# EAGLE board Filter Board (EAGLE 9.5.1)
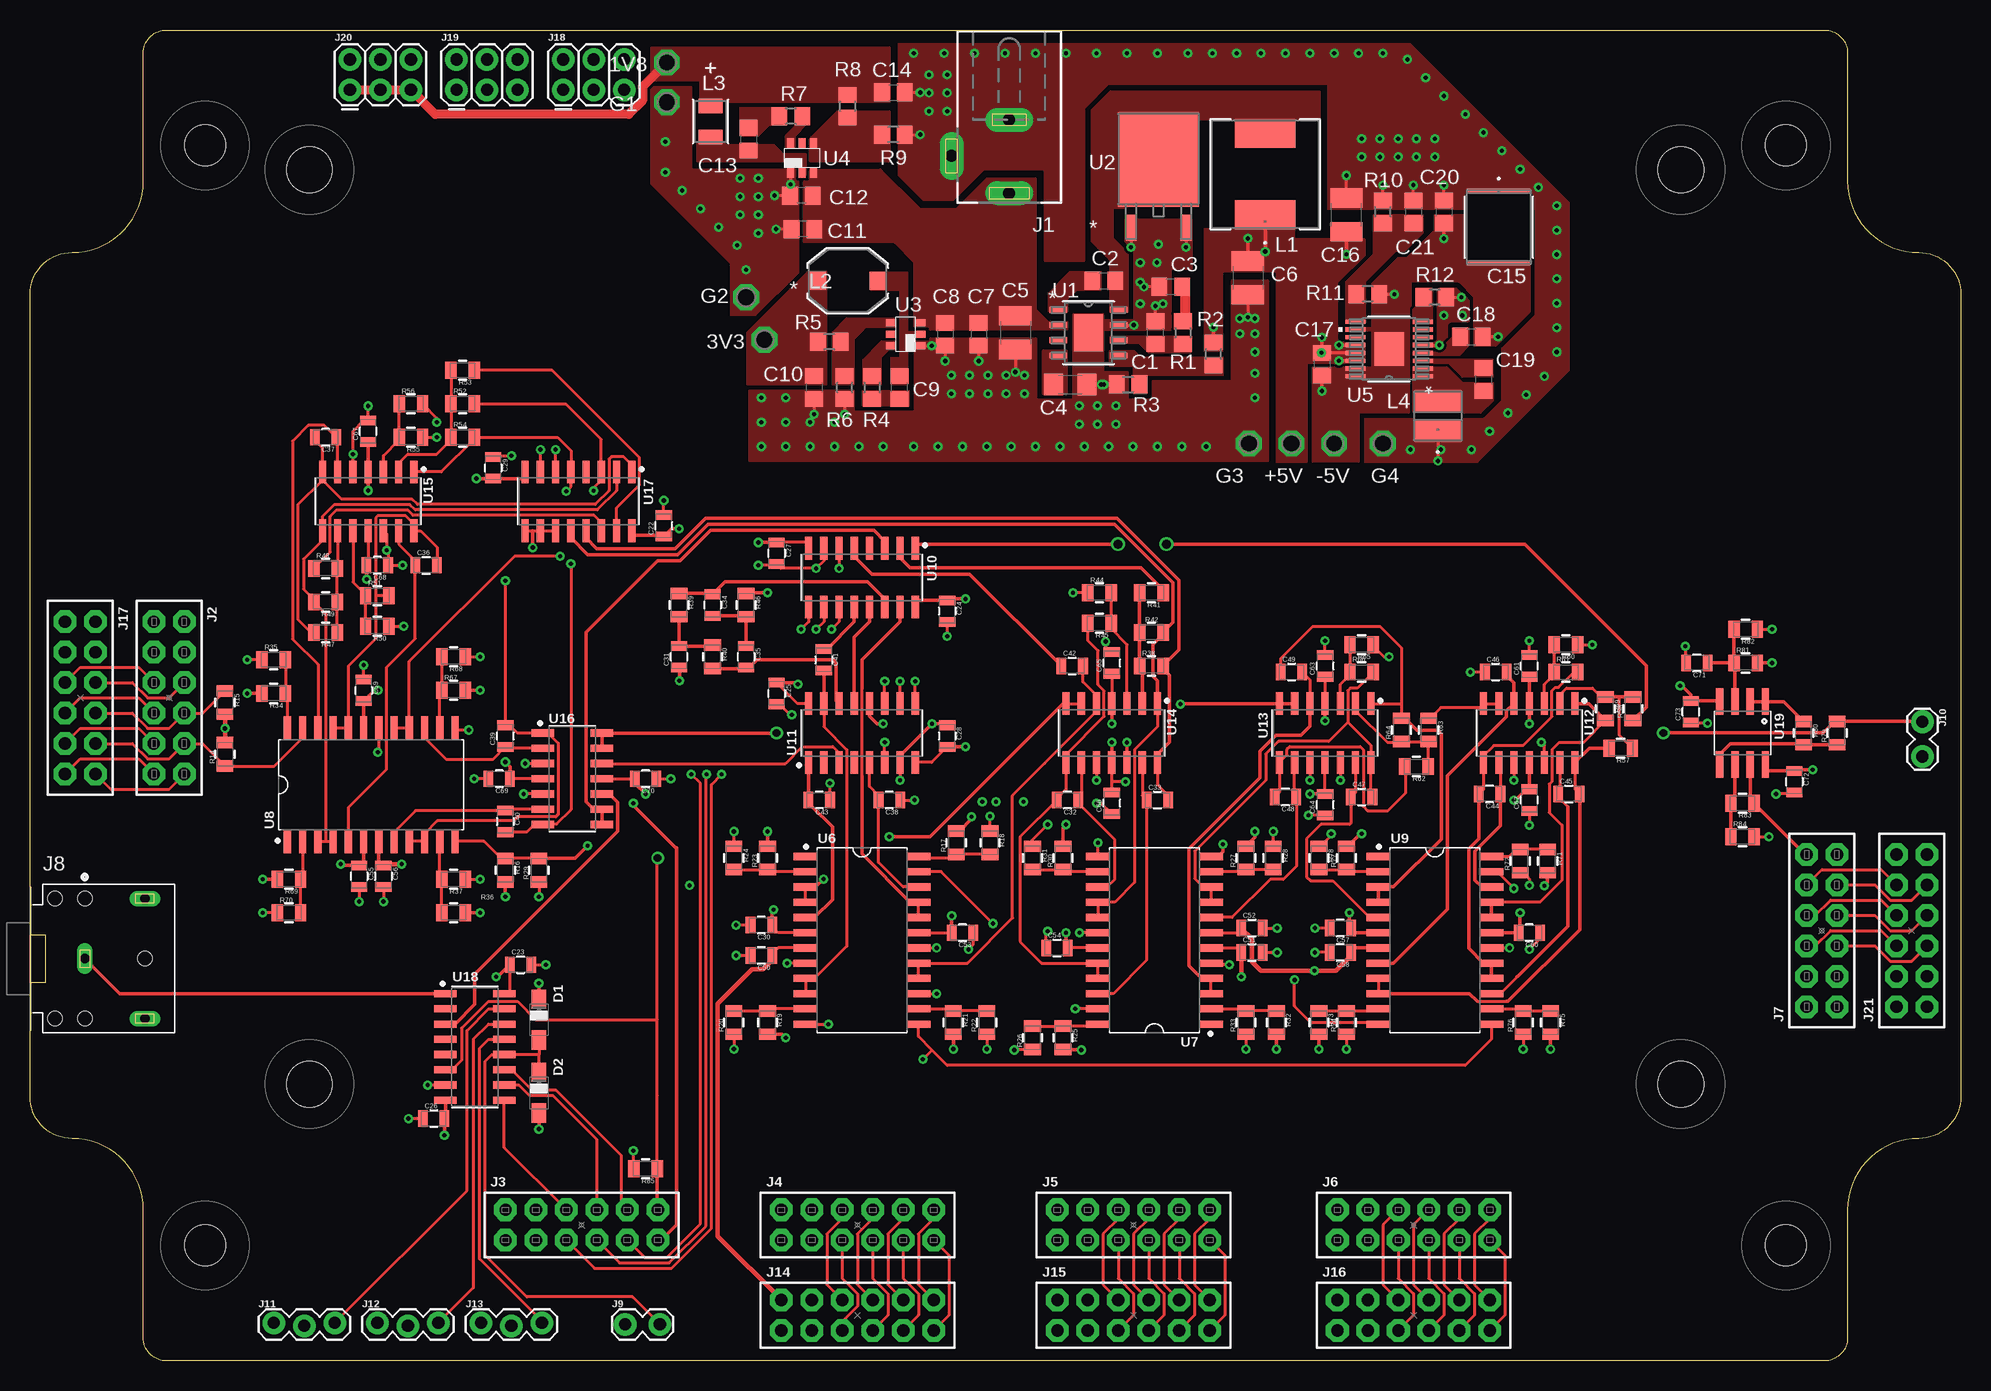
[diagram p5: board, top side]
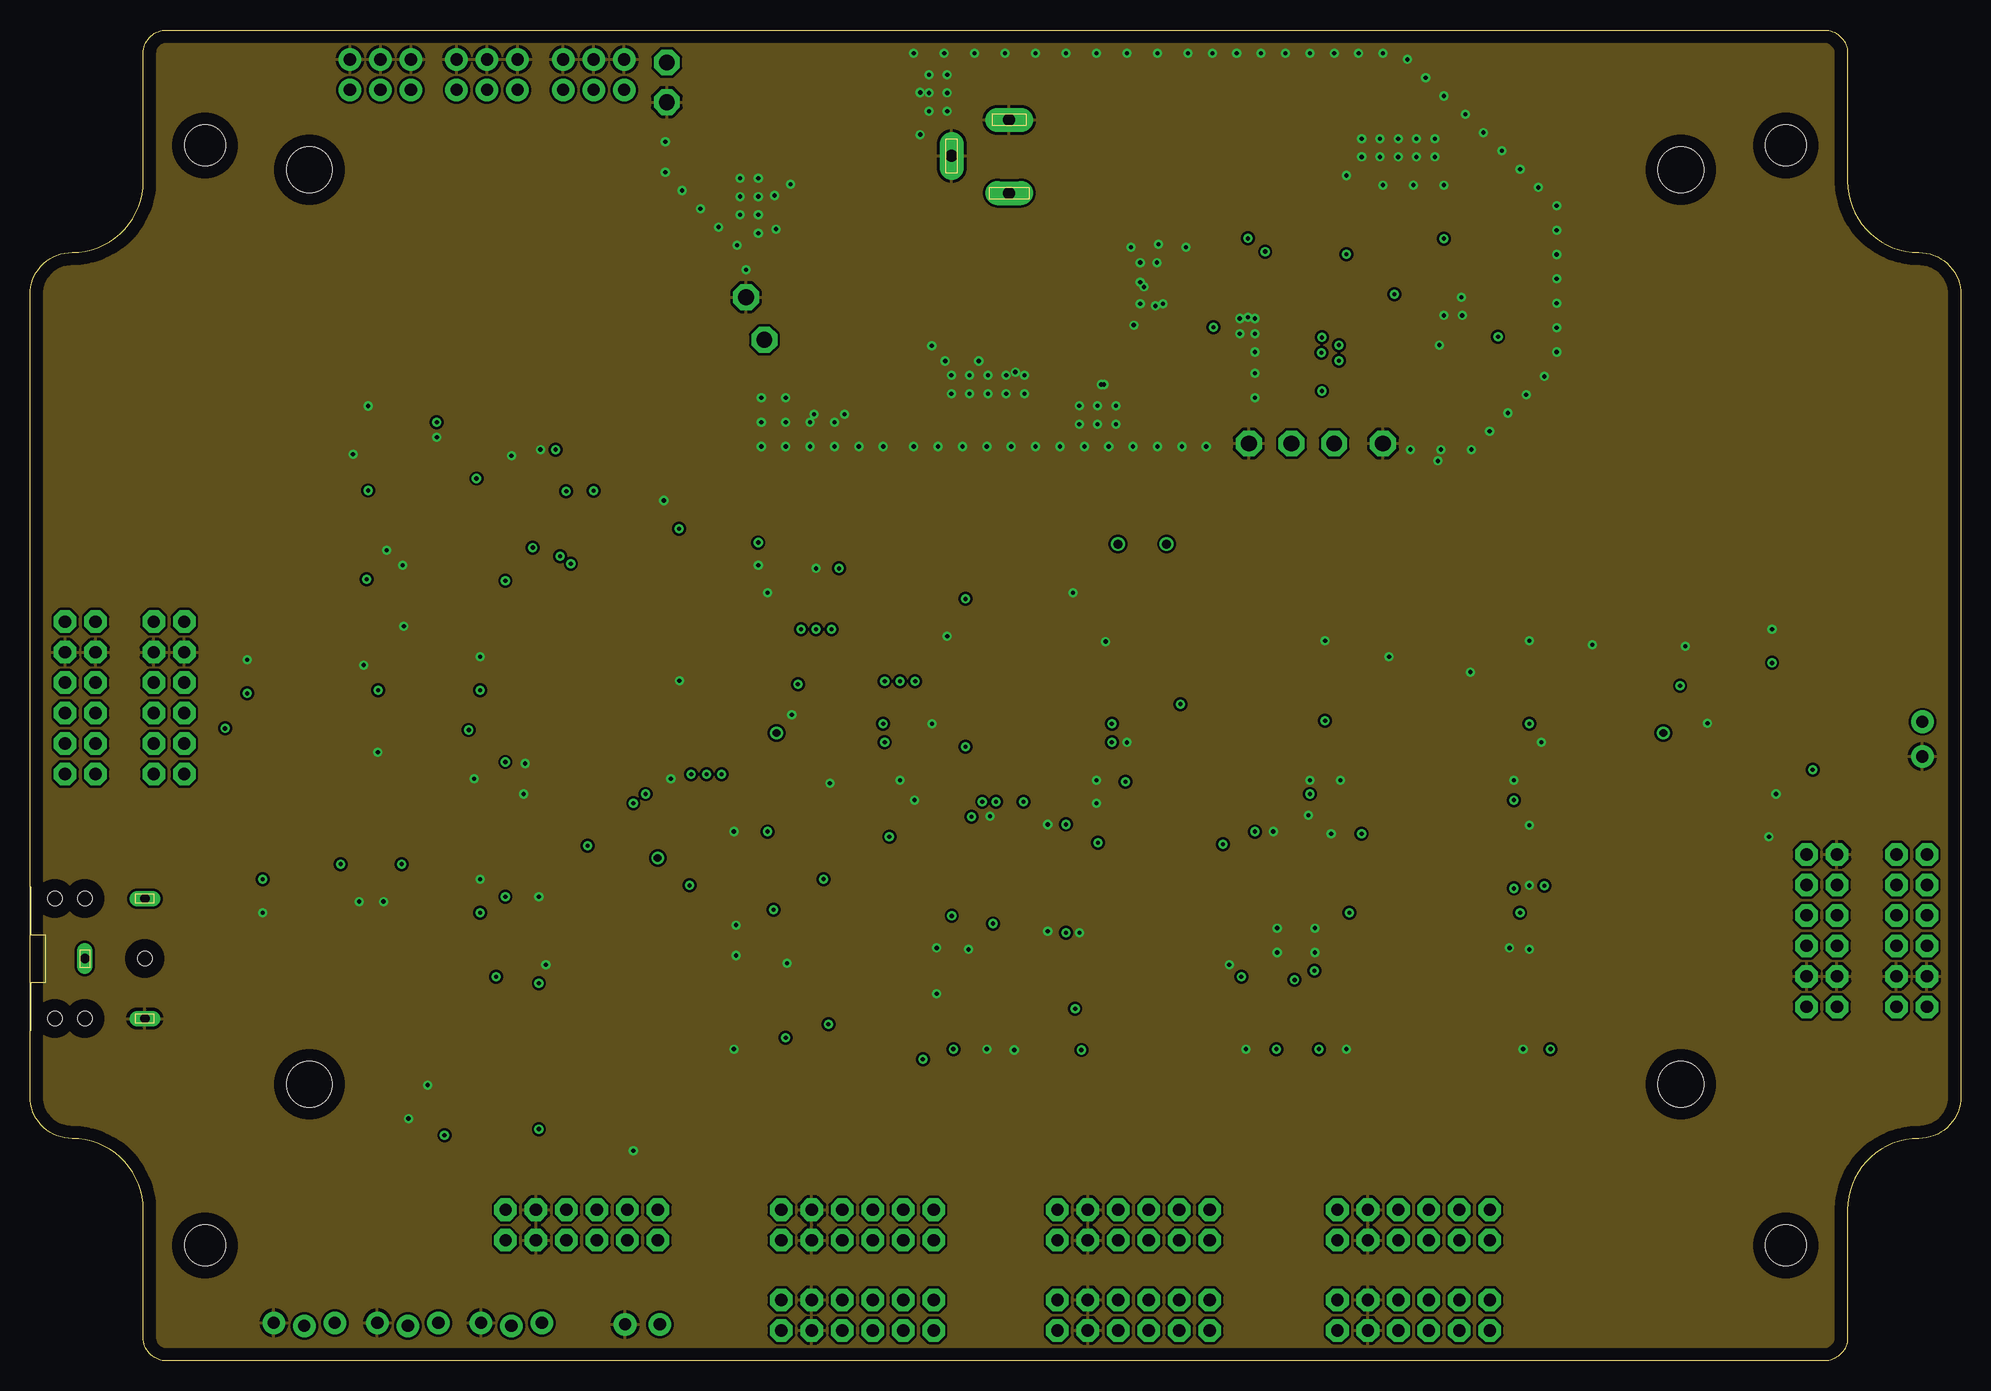
[diagram p6: board, inner layer Route2]
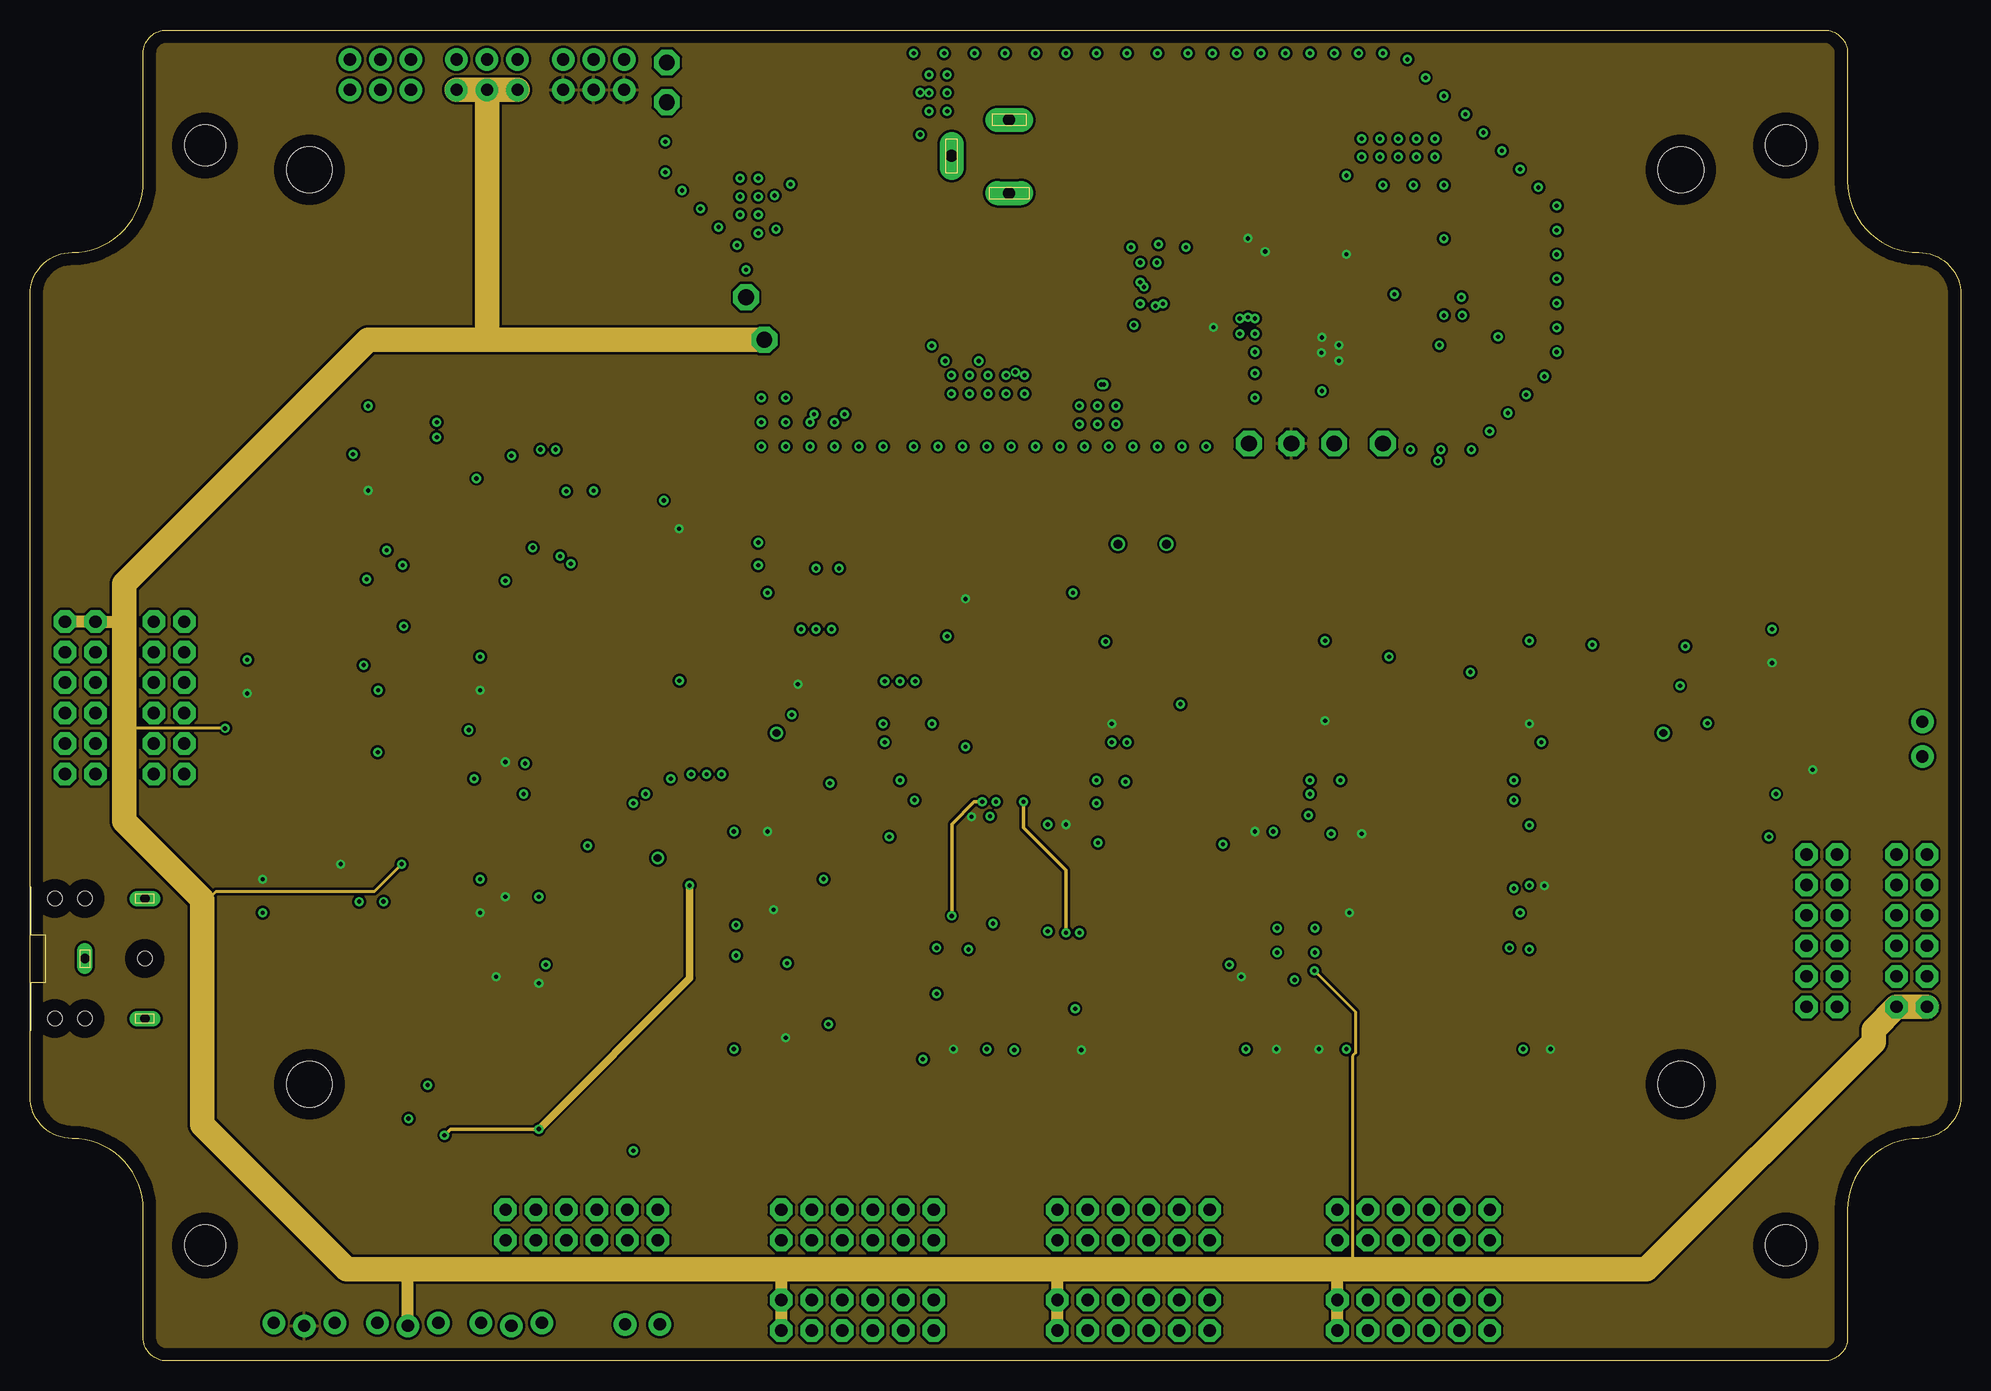
[diagram p7: board, inner layer Route15]
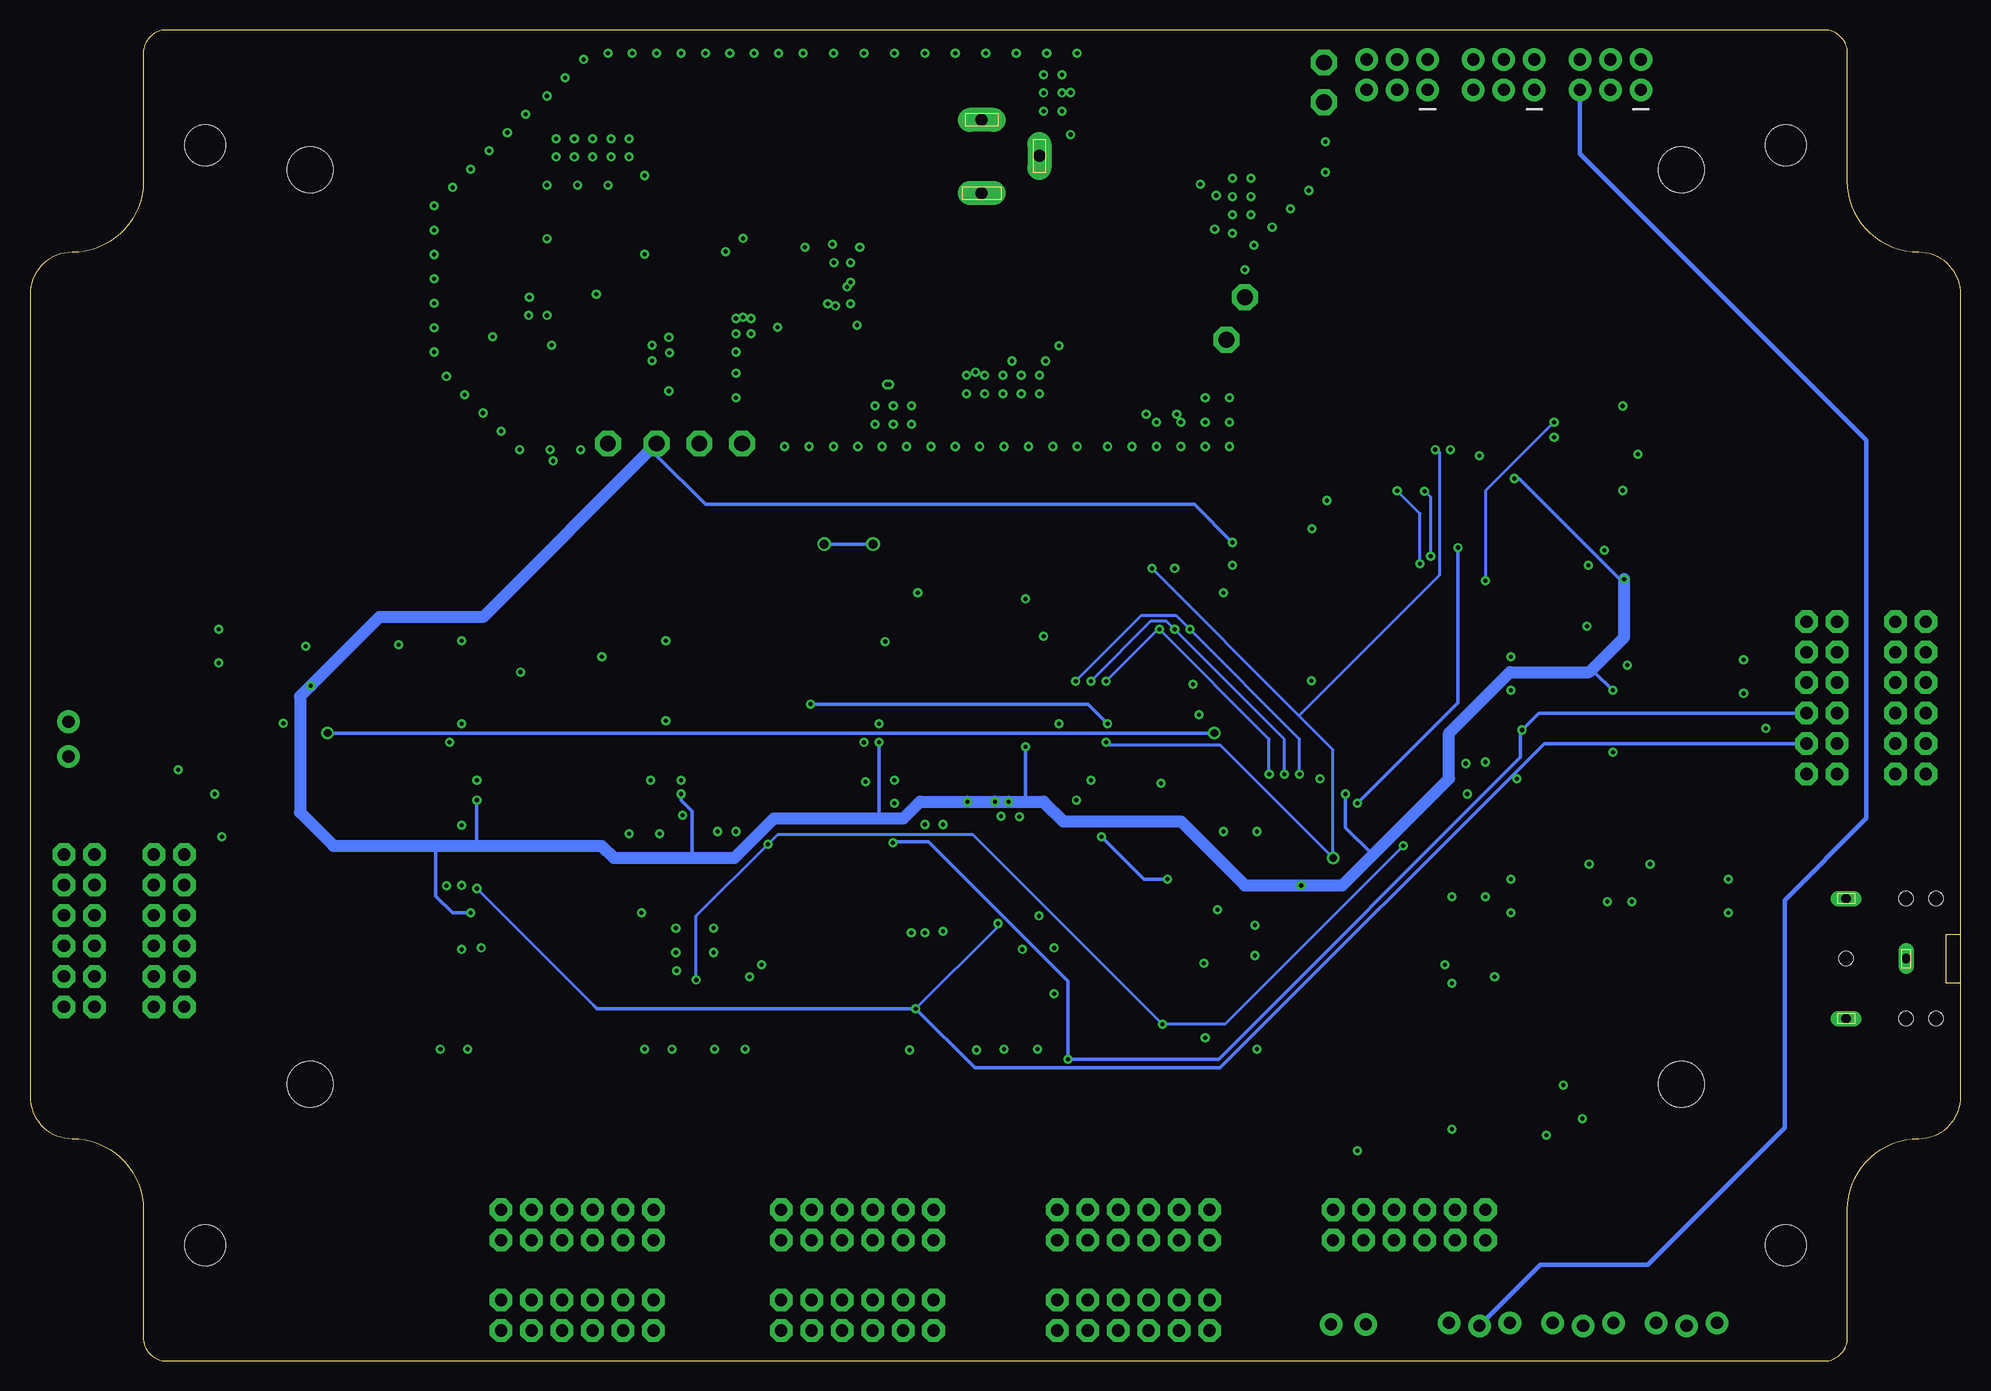
[diagram p8: board, bottom side, seen from below]

Size 160.95 x 110.91 mm. Coordinates in mm from the lower left corner, seen from the top.
Outline: 149.56,110.91 arc-90 151.5,108.97 151.5,98.32 arc90 157.44,92.38 arc-90 160.95,88.87 160.95,22.04 arc-90 157.44,18.53 arc90 151.5,12.59 151.5,1.94 arc-90 149.56,0 11.39,0 arc-90 9.45,1.94 9.45,12.59 arc90 3.51,18.53 arc-90 0,22.04 0,88.87 arc-90 3.51,92.38 arc90 9.45,98.32 9.45,108.97 arc-90 11.39,110.91 149.56,110.91
Copper layers (1+2*15+16): Top 0.035mm / dielectric 1.5mm / Route2 0.035mm / dielectric 0.15mm / Route15 0.035mm / dielectric 0.2mm / Bottom 0.035mm
Design rules "default *": minimum track width 6mil, minimum drill 0.35mm, track to track 8mil, track to pad 8mil, pad to pad 8mil, via to via 8mil, smd to smd 6mil, copper to edge 40mil, drill to drill 6mil, minimum pad ring 10mil, minimum via ring 8mil, stop-mask expansion 4mil, vias tented up to drill 15mil, thermal gap 10mil
Net classes: 0 default: width 0.254 mm; 1 Power: width 0.254 mm, clearance 0.203 mm to class 0; 2 GND: width 0.254 mm, clearance 0.203 mm to class 0, clearance 0.254 mm to class 1
Holes 3.4 mm at 14.59,101.29 14.59,9.62 146.36,9.62 146.36,101.29
Holes 3.81 mm at 23.29,99.27 23.29,23.07 137.59,23.07 137.59,99.27

## Footprints (pad centres in the part's own frame; a part is rotated, then mirrored left to right if it is on the bottom)
P1-13 = drill 1.321 pad 2.159 octagon: TP 0,0
C0805 = smd 1.3 x 1.5: 1 -0.95,0; 2 0.95,0
C1206 = smd 1.6 x 1.8: 1 -1.4,0; 2 1.4,0
C1210 = smd 1.6 x 2.7: 1 -1.4,0; 2 1.4,0
CAP_5750-L = smd 0.356 x 5.309: 1 -3.023,0; 2 3.023,0
0805_H0.75 = smd 0.8 x 1.35: 1 -0.9,0; 2 0.9,0
SOD123 = smd 1.6 x 1.2: 1 -1.7,0; 2 1.7,0
DCJ0202 = drill 1 pad 2 long: 1 0,3.1; 2 4.8,0; 3 0,-3
FEMALE_HEADER-2X6 = drill 1.016 pad 1.88 octagon: 1 0,0; 2 0,2.54; 3 2.54,0; 4 2.54,2.54; 5 5.08,0; 6 5.08,2.54; 7 7.62,0; 8 7.62,2.54; 9 10.16,0; 10 10.16,2.54; 11 12.7,0; 12 12.7,2.54
CUI_SJ1-3523N = drill 0.8 long: 1 0,0; 2 5,-5; 3 5,5 | hole 1.2: -2.5,5; 0,5; 5,0; -2.5,-5; 0,-5
1X02_LOCK = drill 1.016 pad 1.88: 1 -0.178,0; 2 2.718,0
1X03_LOCK = drill 1.016 pad 1.88: 1 0,0.127; 2 2.54,-0.127; 3 5.08,0.127
2X3 = drill 1.016 pad 1.88: 1 0,0; 2 0,2.54; 3 2.54,0; 4 2.54,2.54; 5 5.08,0; 6 5.08,2.54
IND_IHLP-3232DZ = smd 2.413 x 5.055: 1 -3.391,0; 2 3.391,0
IND_5022 = smd 1.45 x 1.5: 1 -2.525,0; 2 2.525,0
IND_NLCV32TR = smd 1.194 x 2.007: 1 -1.295,0; 2 1.295,0
IND_IFSC_1515AH-L = smd 1.803 x 3.912: 1 -1.257,0; 2 1.257,0
R0805 = smd 1.3 x 1.5: 1 -0.95,0; 2 0.95,0
0805 = smd 0.95 x 1.4: 1 -0.975,0; 2 0.975,0
DDA8_3P1X2P4-L = smd 1.473 x 0.483: 1 -2.515,1.905; 2 -2.515,0.635; 3 -2.515,-0.635; 4 -2.515,-1.905; 5 2.515,-1.905; 6 2.515,-0.635; 7 2.515,0.635; 8 2.515,1.905 | smd 2.4 x 3.1: EPAD 0,0
DPAK-L = smd 0.889 x 2.184: 1 -2.29,-5.728; 3 2.29,-5.728 | smd 6.731 x 7.899: 2 0,-0.051
TSOT23-6_DDC = smd 0.6 x 0.8: 1 -0.95,-1.25; 2 0,-1.25; 3 0.95,-1.25; 4 0.95,1.25; 5 0,1.25; 6 -0.95,1.25
PWP16 = smd 1.676 x 0.356: 1 -2.819,2.275; 2 -2.819,1.625; 3 -2.819,0.975; 4 -2.819,0.325; 5 -2.819,-0.325; 6 -2.819,-0.975; 7 -2.819,-1.625; 8 -2.819,-2.275; 9 2.819,-2.275; 10 2.819,-1.625; 11 2.819,-0.975; 12 2.819,-0.325; 13 2.819,0.325; 14 2.819,0.975; 15 2.819,1.625; 16 2.819,2.275 | smd 2.464 x 2.819: 17 0,0
SOIC127P1030X250-25T200X300 = smd 2 x 0.6: 1 -4.705,6.985; 2 -4.705,5.715; 3 -4.705,4.445; 4 -4.705,3.175; 5 -4.705,1.905; 6 -4.705,0.635; 7 -4.705,-0.635; 8 -4.705,-1.905; 9 -4.705,-3.175; 10 -4.705,-4.445; 11 -4.705,-5.715; 12 -4.705,-6.985; 13 4.705,-6.985; 14 4.705,-5.715; 15 4.705,-4.445; 16 4.705,-3.175; 17 4.705,-1.905; 18 4.705,-0.635; 19 4.705,0.635; 20 4.705,1.905; 21 4.705,3.175; 22 4.705,4.445; 23 4.705,5.715; 24 4.705,6.985
SOIC127P600X144-16 = smd 1.901 x 0.599: 1 -2.455,4.445; 2 -2.455,3.175; 3 -2.455,1.905; 4 -2.455,0.635; 5 -2.455,-0.635; 6 -2.455,-1.905; 7 -2.455,-3.175; 8 -2.455,-4.445; 9 2.455,-4.445; 10 2.455,-3.175; 11 2.455,-1.905; 12 2.455,-0.635; 13 2.455,0.635; 14 2.455,1.905; 15 2.455,3.175; 16 2.455,4.445
SOIC127P600X144-14 = smd 1.901 x 0.599: 1 -2.455,3.81; 2 -2.455,2.54; 3 -2.455,1.27; 4 -2.455,0; 5 -2.455,-1.27; 6 -2.455,-2.54; 7 -2.455,-3.81; 8 2.455,-3.81; 9 2.455,-2.54; 10 2.455,-1.27; 11 2.455,0; 12 2.455,1.27; 13 2.455,2.54; 14 2.455,3.81
SO08 = smd 0.61 x 2.21: 1 -1.905,-2.616; 2 -0.635,-2.616; 3 0.635,-2.616; 4 1.905,-2.616; 5 1.905,2.616; 6 0.635,2.616; 7 -0.635,2.616; 8 -1.905,2.616

## Placement (x,y rotation side)
1V8  TPPAD1-13  [P1-13]  53.09,108.2 0 top
3V3  TPPAD1-13  [P1-13]  61.21,85.09 0 top
+5V  TPPAD1-13  [P1-13]  101.6,76.45 0 top
-5V  TPPAD1-13  [P1-13]  108.71,76.45 0 top
C1  10pF  [C0805]  93.81,85.69 90 top
C2  100nF  [C0805]  89.5,90 0 top
C3  1.2nF  [C0805]  95.08,89.5 180 top
C4  8.2nF  [C1206]  86.7,81.37 0 top
C5  10uF  [C1210]  82.13,85.69 270 top
C6  47uF  [C1210]  101.51,90.26 270 top
C7  10uF  [C0805]  79.08,85.56 270 top
C8  100nF  [C0805]  76.29,85.56 270 top
C9  100nF  [C0805]  72.48,81.11 90 top
C10  22uF  [C0805]  65.37,81.11 270 top
C11  10uF  [C0805]  64.43,94.32 180 top
C12  100nF  [C0805]  64.3,97.12 180 top
C13  100nF  [C0805]  59.91,101.82 270 top
C14  22uF  [C0805]  71.97,105.7 0 top
C15  47uF  [CAP_5750-L]  122.43,94.49 270 top
C16  22uF  [C1210]  109.73,95.5 90 top
C17  4.7uF  [C0805]  107.7,83.06 270 top
C18  2.2uF  [C0805]  120.14,85.34 0 top
C19  [C0805]  121.16,81.79 270 top
C20  4.7uF  [C0805]  117.86,95.76 270 top
C21  33pF  [C0805]  115.32,95.76 270 top
C22  0.1uF  [0805_H0.75]  52.83,69.6 90 top
C23  0.1uF  [0805_H0.75]  40.89,33.02 0 top
C24  0.1uF  [0805_H0.75]  76.45,62.48 270 top
C25  0.1uF  [0805_H0.75]  62.23,55.63 270 top
C26  0.1uF  [0805_H0.75]  33.66,20.19 0 top
C27  0.1uF  [0805_H0.75]  62.23,67.31 270 top
C28  0.1uF  [0805_H0.75]  76.45,52.07 270 top
C29  0.1uF  [0805_H0.75]  38.61,74.42 270 top
C30  0.1uF  [0805_H0.75]  60.96,36.32 180 top
C31  10uF  [0805_H0.75]  54.1,58.67 90 top
C32  10nF  [0805_H0.75]  86.49,46.74 180 top
C33  10nF  [0805_H0.75]  93.98,46.74 0 top
C34  5.6uF  [0805_H0.75]  56.9,62.99 270 top
C35  5.6uF  [0805_H0.75]  59.69,58.67 270 top
C36  10nF  [0805_H0.75]  33.02,66.29 0 top
C37  10nF  [0805_H0.75]  24.64,76.96 180 top
C38  10nF  [0805_H0.75]  71.63,46.74 180 top
C39  10nF  [0805_H0.75]  39.62,52.07 90 top
C40  10nF  [0805_H0.75]  39.62,44.96 270 top
C41  10nF  [0805_H0.75]  66.17,58.42 270 top
C42  10nF  [0805_H0.75]  86.87,57.91 0 top
C43  10nF  [0805_H0.75]  65.79,46.74 180 top
C44  10nF  [0805_H0.75]  121.67,47.24 180 top
C45  10nF  [0805_H0.75]  128.27,47.24 0 top
C46  10nF  [0805_H0.75]  122.17,57.4 0 top
C47  10nF  [0805_H0.75]  111,46.99 0 top
C48  10nF  [0805_H0.75]  104.65,46.99 180 top
C49  10nF  [0805_H0.75]  105.16,57.4 0 top
C50  0.1uF  [0805_H0.75]  60.96,33.78 180 top
C51  0.1uF  [0805_H0.75]  101.85,34.04 0 top
C52  0.1uF  [0805_H0.75]  101.85,36.07 0 top
C53  0.1uF  [0805_H0.75]  77.72,35.69 180 top
C54  0.1uF  [0805_H0.75]  85.6,34.42 0 top
C55  0.1uF  [0805_H0.75]  27.43,40.39 270 top
C56  0.1uF  [0805_H0.75]  29.46,40.39 270 top
C57  0.1uF  [0805_H0.75]  109.22,36.07 180 top
C58  0.1uF  [0805_H0.75]  109.22,34.04 180 top
C59  0.1uF  [0805_H0.75]  27.81,55.88 270 top
C60  0.1uF  [0805_H0.75]  124.97,35.69 180 top
C61  0.1uF  [0805_H0.75]  124.97,57.91 90 top
C62  0.1uF  [0805_H0.75]  124.97,46.74 90 top
C63  0.1uF  [0805_H0.75]  107.95,57.91 90 top
C64  0.1uF  [0805_H0.75]  107.95,46.35 90 top
C65  0.1uF  [0805_H0.75]  90.17,58.17 90 top
C66  0.1uF  [0805_H0.75]  90.17,46.48 90 top
C67  0.1uF  [0805_H0.75]  28.19,77.47 90 top
C68  0.1uF  [0805_H0.75]  28.96,66.29 180 top
C69  0.1uF  [0805_H0.75]  39.12,48.51 180 top
C70  0.1uF  [0805_H0.75]  51.31,48.51 180 top
C71  0.1uF  [0805_H0.75]  138.94,58.17 180 top
C72  0.1uF  [0805_H0.75]  147.07,48.26 270 top
C73  0.1uF  [0805_H0.75]  138.43,54.1 90 top
D1  SBR80520LT3G  [SOD123]  42.42,28.45 270 top
D2  SBR80520LT3G  [SOD123]  42.42,22.35 270 top
G1  TPPAD1-13  [P1-13]  53.09,104.9 0 top
G2  TPPAD1-13  [P1-13]  59.69,88.65 0 top
G3  TPPAD1-13  [P1-13]  105.16,76.45 0 top
G4  TPPAD1-13  [P1-13]  112.78,76.45 0 top
J1  DCJ0202  [DCJ0202]  81.62,100.42 180 top
J2  ZYBO_JF  [FEMALE_HEADER-2X6]  10.33,61.61 270 top
J3  ZYBO_JE  [FEMALE_HEADER-2X6]  39.63,10.06 0 top
J4  ZYBO_JD  [FEMALE_HEADER-2X6]  62.63,10.06 0 top
J5  ZYBO_JC  [FEMALE_HEADER-2X6]  85.63,10.06 0 top
J6  ZYBO_JB  [FEMALE_HEADER-2X6]  108.98,10.06 0 top
J7  A_XADC  [FEMALE_HEADER-2X6]  150.62,29.51 90 top
J8  SJ1-3523N  [CUI_SJ1-3523N]  4.57,33.53 0 top
J9  Vin_HEADER  [1X02_LOCK]  49.78,3.05 0 top
J10  Vout_HEADER  [1X02_LOCK]  157.73,53.09 270 top
J11  5V0_SENSOR  [1X03_LOCK]  20.32,3.05 0 top
J12  3V3_SENSOR  [1X03_LOCK]  28.96,3.05 0 top
J13  1V8_SENSOR  [1X03_LOCK]  37.59,3.05 0 top
J14  BRKOUT_JD  [FEMALE_HEADER-2X6]  62.63,2.54 0 top
J15  BRKOUT_JC  [FEMALE_HEADER-2X6]  85.63,2.54 0 top
J16  BRKOUT_JB  [FEMALE_HEADER-2X6]  108.98,2.54 0 top
J17  BRKOUT_JF  [FEMALE_HEADER-2X6]  2.92,61.61 270 top
J18  5V0_CONN  [2X3]  44.45,105.92 0 top
J19  3V3_CONN  [2X3]  35.56,105.92 0 top
J20  1V8_CONN  [2X3]  26.67,105.92 0 top
J21  BRKOUT_JD  [FEMALE_HEADER-2X6]  158.12,29.51 90 top
L1  IHLP3232DZER4R7M11  [IND_IHLP-3232DZ]  102.96,98.89 90 top
L2  4.7uH  [IND_5022]  68.16,90 0 top
L3  2.2uH  [IND_NLCV32TR]  56.73,103.29 270 top
L4  15uH  [IND_IFSC_1515AH-L]  117.35,78.74 90 top
R1  [R0805]  96.1,85.69 270 top
R2  [R0805]  98.64,83.91 90 top
R3  [R0805]  91.53,81.37 0 top
R4  30  [R0805]  70.19,81.11 270 top
R5  30.9k  [R0805]  66.64,84.92 180 top
R6  10k  [R0805]  67.91,81.11 90 top
R7  30  [R0805]  63.41,103.72 180 top
R8  12.4k  [R0805]  68.16,104.56 90 top
R9  10k  [R0805]  71.97,102.2 180 top
R10  1000k  [R0805]  112.78,95.76 90 top
R11  255k  [R0805]  111.51,88.9 180 top
R12  100k  [R0805]  117.09,88.65 180 top
R14  4.7k  [0805]  16.26,50.55 90 top
R15  4.7k  [0805]  16.26,54.86 270 top
R16  10k  [0805]  39.62,40.89 270 top
R17  10k  [0805]  77.22,43.18 90 top
R18  10k  [0805]  80.01,43.18 270 top
R19  10k  [0805]  61.47,28.19 270 top
R20  10k  [0805]  58.67,28.19 90 top
R21  10k  [0805]  76.96,28.19 270 top
R22  10k  [0805]  79.76,28.19 90 top
R23  10k  [0805]  61.47,41.91 90 top
R24  10k  [0805]  58.67,41.91 270 top
R25  10k  [0805]  86.11,26.92 270 top
R26  10k  [0805]  83.57,26.92 90 top
R27  10k  [0805]  101.35,41.91 90 top
R28  10k  [0805]  103.63,41.91 270 top
R29  10k  [0805]  42.42,40.89 90 top
R30  10k  [0805]  86.11,41.91 90 top
R31  10k  [0805]  83.57,41.91 270 top
R32  10k  [0805]  103.89,28.19 270 top
R33  10k  [0805]  101.35,28.19 90 top
R34  10k  [0805]  20.32,55.63 180 top
R35  10k  [0805]  20.32,58.42 0 top
R36  10k  [0805]  35.31,37.34 0 top
R37  10k  [0805]  35.31,40.13 180 top
R38  100k  [0805]  93.47,57.91 0 top
R39  470  [0805]  54.1,62.99 270 top
R40  470  [0805]  56.9,58.67 270 top
R41  100k  [0805]  93.47,64.01 180 top
R42  100k  [0805]  93.47,60.71 0 top
R44  33k  [0805]  89.15,64.01 0 top
R45  100k  [0805]  89.15,61.47 180 top
R46  220  [0805]  59.69,62.99 270 top
R47  100k  [0805]  24.64,60.71 180 top
R48  100k  [0805]  24.64,66.04 0 top
R49  100k  [0805]  24.64,63.25 180 top
R50  91k  [0805]  28.96,61.21 180 top
R51  100k  [0805]  28.96,63.75 0 top
R52  100k  [0805]  36.07,79.76 0 top
R53  100k  [0805]  36.07,82.55 180 top
R54  100k  [0805]  36.07,76.96 0 top
R55  160k  [0805]  31.75,76.96 180 top
R56  100k  [0805]  31.75,79.76 0 top
R57  100k  [0805]  132.59,51.05 180 top
R58  100k  [0805]  133.6,54.36 90 top
R59  100k  [0805]  131.32,54.36 270 top
R60  50k  [0805]  128.02,59.69 180 top
R61  100k  [0805]  128.02,57.4 0 top
R62  100k  [0805]  115.57,49.53 180 top
R63  100k  [0805]  116.59,52.58 270 top
R64  100k  [0805]  114.3,52.58 90 top
R65  50k  [0805]  111,59.69 180 top
R66  100k  [0805]  111,57.4 0 top
R67  10k  [0805]  35.31,55.88 0 top
R68  10k  [0805]  35.31,58.67 180 top
R69  10k  [0805]  21.59,40.13 180 top
R70  10k  [0805]  21.59,37.34 0 top
R71  10k  [0805]  126.49,41.66 270 top
R72  10k  [0805]  124.21,41.66 90 top
R73  10k  [0805]  107.44,28.19 270 top
R74  10k  [0805]  109.73,28.19 90 top
R75  10k  [0805]  126.75,28.19 270 top
R76  10k  [0805]  124.46,28.19 90 top
R77  10k  [0805]  109.73,41.91 90 top
R78  10k  [0805]  107.44,41.91 270 top
R79  18k  [0805]  150.62,52.32 90 top
R80  1.8k  [0805]  147.83,52.32 270 top
R81  18k  [0805]  143,58.17 0 top
R82  2k  [0805]  143,60.96 180 top
R83  1.8k  [0805]  142.75,46.48 180 top
R84  18k  [0805]  142.75,43.69 0 top
R85  10k  [0805]  51.31,16 180 top
U1  TPS54531DDARDDA8_3P1X2P4-L  [DDA8_3P1X2P4-L]  88.23,85.69 0 top
U2  VS-50WQ04FNPBFDPAK-L  [DPAK-L]  94.07,100.16 0 top
U3  TPS56339  [TSOT23-6_DDC]  72.99,85.56 90 top
U4  TPS56339  [TSOT23-6_DDC]  64.35,100.24 0 top
U5  LM43601PWPR  [PWP16]  113.28,84.33 180 top
U6  X9258_A  [SOIC127P1030X250-25T200X300]  69.34,35.05 0 top
U7  X925_B  [SOIC127P1030X250-25T200X300]  93.73,35.05 180 top
U8  X9258_C  [SOIC127P1030X250-25T200X300]  28.45,48.01 90 top
U9  X9258_D  [SOIC127P1030X250-25T200X300]  117.09,35.05 0 top
U10  CD74HCT4051  [SOIC127P600X144-16]  69.34,65.28 270 top
U11  CD74HCT4051  [SOIC127P600X144-16]  69.34,52.32 90 top
U12  OPA4197  [SOIC127P600X144-14]  124.97,52.32 270 top
U13  OPA4197  [SOIC127P600X144-14]  107.95,52.32 270 top
U14  OPA4197  [SOIC127P600X144-14]  90.17,52.32 270 top
U15  OPA4197  [SOIC127P600X144-14]  28.19,71.63 270 top
U16  OPA4197  [SOIC127P600X144-14]  45.21,48.51 0 top
U17  CD74HCT4053  [SOIC127P600X144-16]  45.72,71.63 270 top
U18  CD74HCT4051  [SOIC127P600X144-16]  37.08,26.16 0 top
U19  OPA2197  [SO08]  142.75,52.32 180 top

## Tracks (layer width: path | path; a pad name or v marks a point on that pad's centre or on a via)
0.5V_REF
  Top 0.305: U19.2 U19.1 146.19,54.94 R80.1
1V8SENSOR_IN
  Top 0.254: U18.13 38.23,26.8 37.47,26.04 37.47,8.51 42.67,3.3 J13.3
3.5MM_IN
  Top 0.305: J8.1 7.49,30.61 U18.1
3V3SENSOR_IN
  Top 0.254: U18.14 38.23,28.07 36.96,26.8 36.96,6.1 J12.3
5V0SENSOR_IN
  Top 0.254: 25.4,3.19 J11.3 36.42,14.2 36.42,27.53 38.23,29.34 U18.15
12V0
  pour Top (no thermals): 86.45,85.94 75.02,85.94 75.02,86.19 73.75,86.19 73.75,91.53 72.06,93.22 64.52,93.22 64.52,98.3 65.02,98.3 65.02,99.28 68.03,99.28 70.87,99.31 74.17,96.01 77.22,96.01 79.76,98.55 83.82,98.55 83.82,87.63 84.84,86.61 86.45,86.61
!HP!/LP_TOGGLE  (via drill 0.35)
  Top 0.254: U17.9 41.91,69.17 U17.10 U17.11 43.81,68.58
  Top 0.305: J3.11 52.59,10.06 53.88,11.35 53.88,42.67 | 53.88,42.67 53.88,42.74 | 53.88,42.67 50.29,46.26 v50.29,46.48 | v41.91,67.78 41.91,69.17
  Bottom 0.305: v50.29,46.48 41.91,54.86 v41.91,67.78
!SYSTEM_EN  (via drill 0.35, 0.65)
  Top 0.254: U18.6 35.18,24.26 35.97,25.04 35.97,27.72 38.21,29.97 40.63,29.97 42.15,28.45 52.28,28.45 | U10.6 v67.44,66.04 | 52.28,22.1 R85.1 52.28,28.45 | U17.6 v43.81,75.95 | 52.28,28.45 52.28,41.87 v52.32,41.91 | U11.6 v71.25,51.56
  Top 0.305: J3.12 52.28,12.65 R85.1
  Bottom 0.254: v71.25,51.56 71.02,51.34 61.75,51.34 v52.32,41.91 52.32,50.93 55.18,53.78 | 55.18,53.78 v67.44,66.04 | v43.81,75.95 43.71,75.95 43.49,75.72 43.49,65.48 55.18,53.78
!WP  (via drill 0.35)
  Top 0.254: R29.2 R16.1 39.28,41.87 37.85,43.3 U8.12 | U9.12 111.76,28.07 111.63,28.19 106.78,28.19 105.41,29.56 v105.41,31.75 | U6.12 v66.55,28.07
  Top 0.305: R29.2 45.42,41.87 v46.48,42.93 | U7.12 99.07,42.04 99.44,42.41 v99.44,43.05
  Bottom 0.254: v105.41,31.75 105.41,37.08 v99.44,43.05 98.61,43.89 82.37,43.89 v66.55,28.07 61.34,28.07 v46.48,42.93
+1V8
  Top 0.762: 1V8.TP 51.05,106.17 51.05,105.03 49.91,103.89 33.78,103.89 J20.5 J20.3 J20.1
  Bottom 0.356: J20.5 31.75,100.58 7.87,76.71 7.87,45.21 14.69,38.4 14.69,19.42 26.11,8 35.05,8 J13.2
  pour Top (no thermals): 55.88,104.14 55.88,106.68 51.82,106.68 51.82,109.47 71.63,109.47 71.63,104.9 57.66,104.9 57.66,104.14
+3V3  (via drill 0.35)
  Top 0.254: U7.7 100.57,35.69 C52.1 | U6.7 62.37,34.42 61.86,33.91 C50.1
  Top 0.305: U9.7 110.37,34.42 110.12,34.16 C58.1 | U8.7 29.08,41.67 C56.1
  Top 0.356: R15.2 v16.26,52.7 R14.2 | C56.1 29.58,41.4 v30.99,41.4 | C50.1 61.86,33.4 61.1,32.64 60.2,32.64 57.3,29.75 57.3,10.4 J14.2 | C52.1 101.85,35.17 101.85,33.25 102.59,32.51 v107.06,32.51 108.85,32.51 110.12,33.78 C58.1
  Route15 0.254: v16.26,52.7 8,52.7 7.87,52.83 | v30.99,41.4 28.7,39.12 15.49,39.12 14.86,38.48 14.35,38.48 | 109.47,7.62 110.24,8.38 110.24,25.42 110.49,25.67 110.49,29.09 v107.06,32.51
  Route15 1.016: J17.1 J17.2 7.76,61.61 7.87,61.72 | J12.2 31.5,7.62 | J14.1 J14.2 62.63,7.51 62.74,7.62 | J15.1 J15.2 85.63,7.4 85.85,7.62 | J16.1 J16.2 108.98,7.13 109.47,7.62
  Route15 2.032: 3V3.TP 38.35,85.09 | 38.35,85.09 28.19,85.09 7.87,64.77 7.87,61.72 7.87,52.83 7.87,44.96 14.35,38.48 14.35,19.68 26.42,7.62 31.5,7.62 62.74,7.62 85.85,7.62 109.47,7.62 134.75,7.62 153.67,26.54 153.67,27.6 J21.2 J21.1 | J19.3 J19.5 | J19.1 J19.3 | J19.3 38.1,85.34 38.35,85.09
  pour Top (no thermals): 66.38,90.77 64.86,90.77 59.78,85.69 59.78,81.37 66.38,81.37
+5V0  (via drill 0.35)
  Top 0.254: C63.1 U13.4 | U7.6 100.57,34.42 C51.1 | C65.1 U14.4 | 50.28,69.73 50.16,69.85 U17.16 | U16.4 C69.1 | U6.6 62.36,35.69 61.86,36.18 C30.1 | U11.16 63.98,54.78 C25.1 | C23.1 39.99,30.81 39.79,30.61 U18.16
  Top 0.305: U9.6 110.25,35.69 110.12,35.81 C57.1 109.98,36.21 v109.98,37.34 | C61.1 U12.4 v124.97,53.09 | U8.6 27.81,41.67 C55.1 26.02,41.29 v25.91,41.4 | U17.16 50.16,68.92 50.29,68.79 52.74,68.79 C22.1 53.48,69.34 v54.1,69.34 | U10.16 73.79,63.33 73.84,63.38 C24.1 76.57,63.5 v77.98,63.5 | U19.8 144.65,49.15 144.66,49.16 C72.1 147.18,49.28 v148.59,49.28 | L1.1 v102.96,92.45 | R21.2 v76.96,25.99 | R23.2 v61.47,44.12 | R16.2 v39.62,38.69 | R32.2 v103.89,25.99 | R2.2 v98.64,86.14 | C17.1 v107.7,85.29 | v102.11,44.12 102.11,43.65 R27.2 | R34.2 v18.11,55.63 | R69.2 v19.38,40.13 | R36.2 v37.51,37.34 | R67.2 v37.51,55.88 | C16.1 v109.73,92.22 | R73.2 v107.44,25.99 | R75.2 v126.75,25.99 | D1.1 v42.42,31.48 | R81.2 v145.21,58.17 | C6.1 v101.51,93.54 | U5.14 v109.1,83.35 | U5.13 v107.65,84 | U5.12 v109.1,84.65 | C67.1 U15.4 v28.19,72.53 | C69.1 40.02,49.52 v39.62,49.91 | C23.1 38.98,32 v38.86,32 | R19.2 62.7,27.22 v62.99,26.92 | C30.1 61.86,37.48 v61.98,37.59 | C25.1 63.87,56.53 v64.01,56.39 | U14.4 v90.17,53.09 | R17.2 77.47,44.16 78.49,45.17 v78.49,45.34 | R30.2 86.11,44.45 v86.36,44.7 | R77.2 109.86,42.88 110.91,43.94 v111,43.94 | U13.4 v107.95,53.34 | R71.2 126.49,39.86 v126.23,39.6 | R25.2 87.59,25.95 v87.63,25.91
  Top 0.356: C51.1 100.97,34.02 v100.97,32
  pour Top (no thermals): 100.42,94.32 97.88,94.32 97.88,84.16 99.4,84.16 99.4,90.77 103.89,90.81 103.89,74.93 106.43,74.93 106.43,83.19 111.25,83.19 111.25,84.84 108.97,84.84 108.97,89.87 111.25,92.16 111.25,93.47 105.41,93.47 105.5,96.61 100.42,96.61
  pour Route15: 0.09,0.09 160.87,0.09 160.87,111.09 9.4,111.12 9.4,113.54 6.6,113.54 6.6,111.09 0.09,111.09
-5V0  (via drill 0.35)
  Top 0.254: C64.2 U13.11 | U7.19 C54.2 | C66.2 90.17,48.26 | 90.17,48.26 U14.11 | U15.11 28.19,66.43 C68.2 | 41.29,73.52 41.4,73.41 | U16.11 C70.2 | U6.19 C53.2 | C28.2 75.15,49.87 U11.8 | C27.1 64.67,68.21 64.9,67.99 U10.8 | v91.31,48.26 90.17,48.26
  Top 0.305: U9.19 121.93,35.81 122.43,35.81 122.56,35.69 C60.2 124.21,35.83 v124.21,37.34 | U12.11 C62.2 124.71,47.64 123.81,46.74 v123.7,46.74 | U8.19 C59.2 28.71,55.88 v29.01,55.88 | 64.9,67.17 U10.8 | U19.4 140.78,55 C73.2 138.43,55.5 137.67,56.26 v137.54,56.26 | R11.1 v113.74,88.9 | C18.2 v122.37,85.34 | D2.2 v42.42,19.32 | C20.2 v117.86,93.53 | C17.2 v107.7,80.83 | U18.8 34.63,20.27 C26.2 34.55,18.81 v34.54,18.8 | C70.2 50.41,48.14 v51.31,47.24 | C68.2 28.06,65.16 v28.07,65.15 | v37.21,73.53 37.22,73.52 C29.2 38.62,73.53 41.27,73.53 | C27.1 v60.72,68.21 v60.71,68.2 | C28.2 77.97,51.17 v77.98,51.18 | U14.11 v90.17,51.56 | C53.2 v76.82,37.07 v76.83,37.08 | C54.2 86.36,34.55 v86.36,35.69 | C64.2 107.94,47.24 v106.68,47.24 | U17.8 41.27,73.53 | 41.27,73.53 41.29,73.52
  Route15 0.305: v79.38,46.61 78.87,46.61 78.84,46.58 78.69,46.58 76.83,44.73 v76.83,37.08 | v86.36,35.69 86.36,40.89 82.8,44.45 v82.8,46.61 | v34.54,18.8 35.07,19.32 v42.42,19.32
  Route15 0.61: v42.42,19.32 54.99,31.89 v54.99,39.62
  Bottom 0.305: v29.01,55.88 30.54,57.4 30.99,57.4 | v51.31,47.24 51.31,44.45 49.02,42.16 | v28.07,65.15 28.41,65.15 36.8,73.53 v37.21,73.53 | v60.71,68.2 63.88,71.37 104.65,71.37 108.71,75.44 -5V.TP | v77.98,51.18 77.98,46.61 | v90.17,51.56 90.17,45.21 | v106.68,47.24 106.68,46.7 105.77,45.79 105.77,41.93 105.79,41.91 | v123.7,46.74 123.7,42.93 | v124.21,37.34 125.73,37.34 127.13,38.73 127.13,42.8 127,42.93
  Bottom 1.016: -5V.TP 123.19,61.98 131.83,61.98 v137.54,56.26 138.43,55.37 138.43,45.72 135.64,42.93 127,42.93 123.7,42.93 113.28,42.93 112.27,41.91 105.79,41.91 102.23,41.91 98.93,45.21 90.17,45.21 88.14,45.21 86.74,46.61 v82.8,46.61 v80.52,46.61 v79.38,46.61 77.98,46.61 76.45,46.61 74.8,44.96 65.02,44.96 59.69,39.62 v54.99,39.62 51.56,39.62 49.02,42.16 42.67,48.51 42.67,52.32 37.59,57.4 30.99,57.4 28.07,60.33 v28.07,65.15
  pour Top (no thermals): 106.93,82.8 111.89,82.8 111.89,85.85 109.73,85.85 109.73,86.11 111.89,86.11 111.89,89.79 114.05,91.95 114.81,91.95 117.09,94.23 117.09,95.5 124.97,95.5 124.97,87.38 122.17,84.58 120.4,84.58 120.4,88.65 119.13,89.92 115.06,89.92 115.06,87.88 114.94,87.76 114.94,78.99 110.74,78.99 110.74,74.93 106.93,74.93
ANALOGUE_IN
  Top 0.254: 42.42,25.53 U18.12 38.48,25.53 37.92,24.97 37.92,8.81 41.4,5.33 50.22,5.33 J9.2 | D2.1 42.42,25.53 | D1.2 42.42,25.53
BP2_IN
  Top 0.305: C42.1 78.31,65.57 70.19,65.57 68.71,67.06 U10.5
BP2_OUT
  Top 0.254: C43.2 | U6.5 65.41,36.96
  Top 0.305: U11.1 C43.2 64.9,46.35 65.02,46.23 65.15,46.23 66.88,44.5 66.88,38.43 65.41,36.96
BP6_HPOUT
  Top 0.254: C44.2 121.16,47.64 U12.8 121.16,50.42 122.02,51.28 124.45,51.28 126.87,53.69 126.87,55.86 127.13,56.12 127.4,56.12 128.68,57.4 R61.2
  Top 0.305: U9.16 U9.17 121.16,33.15 119.94,34.37 119.94,42.7 120.77,43.52 C44.2
BP6_IN  (via drill 0.75)
  Top 0.305: U10.1 73.79,68.23 | R58.1 134.71,54.49 134.71,57.95 124.59,68.07 v94.74,68.07 | v90.68,68.07 74,68.07
  Top 0.406: 74,68.07 73.79,67.86 U10.1
  Bottom 0.305: v94.74,68.07 v90.68,68.07
BP6_OUT  (via drill 0.35)
  Top 0.305: U13.6 U13.7 95.93,54.78 v95.89,54.74 | 69.98,55.26 U11.12 69.98,53.72 70.61,53.09 v71.12,53.09
  Bottom 0.305: v95.89,54.74 90.17,54.74 72.77,54.74 v71.12,53.09
FILT_SELECT0  (via drill 0.35)
  Top 0.254: J3.5 47.05,7.72 53.47,7.72 56.8,11.05 56.8,48.03 v57.66,48.9 | U10.11 67.44,61.59 v66.8,60.96 | U11.11 v71.25,56.64
  Bottom 0.254: v57.66,48.9 57.66,51.82 v66.8,60.96 66.93,60.96 v71.25,56.64
FILT_SELECT1  (via drill 0.35)
  Top 0.254: J3.7 49.13,8.18 53.27,8.18 56.34,11.24 56.34,48.9 v56.39,48.9 | U10.10 66.17,61.59 v65.53,60.96 | U11.10 v72.52,56.64
  Bottom 0.254: v56.39,48.9 56.39,51.82 v65.53,60.96 66.24,61.67 67.49,61.67 v72.52,56.64
FILT_SELECT2  (via drill 0.35)
  Top 0.254: J3.9 51.22,8.64 53.09,8.64 55.88,11.43 55.88,48.13 v55.12,48.9 | U10.9 64.9,61.59 v64.26,60.96 | U11.9 v73.79,56.64
  Bottom 0.254: v55.12,48.9 55.12,51.82 v64.26,60.96 65.43,62.13 68.3,62.13 v73.79,56.64
FILTER_IN
  Top 0.305: U18.3 35.43,28.07 37.08,29.71 37.08,32.24 48.97,44.13 48.97,46.55 48.26,47.26 48.26,47.37 47.79,47.37 U16.10 46.99,47.24
FILTER_OUT_BUFF  (via drill 0.65)
  Top 0.305: U16.13 U16.14 v62.23,52.32 | v136.14,52.32 136.16,52.34 149.5,52.34 150.45,53.3 R79.2 157.7,53.3 J10.1
  Bottom 0.305: v62.23,52.32 v136.14,52.32
GND  (via drill 0.35)
  Top 0.254: R9.1 v74.2,102.2 | U2.1 v91.78,92.81 | U2.3 v96.36,92.81 | U1.7 v92.01,86.32 | R35.1 v18.11,58.42 | C3.2 v92.85,89.5 | C20.1 v117.86,97.99 | C4.2 v89.3,81.37 v89.53,81.37 R3.1 | R20.1 v58.67,25.99 | C63.2 v107.95,60.02 | C1.2 v93.81,87.92 | C5.2 v82.13,82.41 | R12.1 v119.33,88.65 | C6.2 v101.51,86.98 | U4.1 v63.4,98.06 | U3.1 v75.17,84.61 | C10.2 v65.37,78.88 | R6.1 v67.91,78.88 | C12.2 v62.07,97.12 | C8.2 v76.29,83.33 | C7.2 v79.08,83.33 | C14.2 v74.2,105.7 | R29.1 v42.42,38.69 | C11.2 v62.2,94.32 | C16.2 v109.73,98.78 | R70.1 v19.38,37.34 | L4.1 v117.35,75 | U5.5 v117.47,84.65 | U18.7 v33.15,22.99 | R76.1 v124.46,25.99 | C46.1 v120.07,57.4 | R10.2 v112.78,97.99 | C21.1 v115.32,97.99 | R28.1 v103.63,44.12 | R33.1 v101.35,25.99 | R22.1 v79.76,25.99 | U11.7 v72.52,48.39 | v27.81,57.99 C59.1 28.18,56.78 | C23.2 v43,33.02 | R18.1 v80.01,45.39 | C26.1 v31.55,20.19 | R24.1 v58.67,44.12 | R37.1 v37.51,40.13 | R68.1 v37.51,58.67 | R74.1 v109.73,25.99 | C22.2 v52.83,71.7 | C24.2 v76.45,60.38 | C30.2 v58.85,36.32 | C61.2 v124.97,60.02 | C50.2 v58.85,33.78 | C51.2 v103.96,34.04 | C52.2 v103.96,36.07 | C55.2 v27.43,38.28 | C56.2 v29.46,38.28 | C57.2 v107.11,36.07 | C58.2 v107.11,34.04 | C62.1 v124.97,44.63 | v31.06,66.29 C68.1 29.86,67.43 v29.72,67.56 29.72,68.92 U15.12 | v28.19,79.58 C67.2 27.82,78.37 26.92,77.47 v26.92,75.56 U15.5 | C70.1 v53.41,48.51 | C69.2 v37.01,48.51 | C38.1 v73.73,46.74 | R44.1 v86.95,64.01 | R50.1 v31.16,61.21 | U16.3 v41.28,49.78 | R60.1 v130.22,59.69 | U6.8 v63.11,33.15 | U6.18 v75.58,34.42 | U6.15 v75.58,30.61 | R82.1 v145.21,60.96 | C71.2 137.97,58.23 v137.97,59.56 | R84.2 v144.95,43.69 | C73.1 138.49,53.14 v139.83,53.14 | U12.10 v123.7,48.39 | U13.12 v109.22,48.39 | U13.10 v106.68,48.39
  Top 0.254: U14.10 v88.9,48.39 | U7.18 v87.49,35.69 | U7.5 98.56,33.02 v99.96,33.02 | U9.18 v123.33,34.42 | C60.1 125.87,35.19 v124.97,34.29 | U12.12 126.24,51.31 v125.98,51.56 | C72.2 146.95,47.24 v145.54,47.24 | U17.7 v42.55,75.95 | C29.1 38.72,75.44 v40.13,75.44 | R55.1 v33.91,76.96 | U8.18 29.08,50.8 v28.99,50.71 | R85.2 50.33,17.48 v50.29,17.53 | R26.1 82.08,25.95 v82.04,25.91 | C53.1 78.62,34.68 v78.23,34.29 | C54.1 84.7,35.68 v84.84,35.81 | R31.1 83.57,43.43 v84.84,44.7 | C66.1 89.27,46.48 v88.9,46.48 | C25.2 62.48,54.73 63.36,53.85 v63.5,53.85 | v60.71,66.29 62.11,66.29 C27.2 62.6,66.04 v65.53,66.04 66.17,66.67 U10.7 | R78.1 107.57,42.88 108.46,43.77 v108.46,43.94 | C64.1 106.56,45.45 v106.55,45.47 | R72.1 124.46,40.68 124.97,40.17 v124.97,39.62 | C65.2 89.66,59.57 v89.66,59.94 | C43.1 66.69,48.12 v66.67,48.13 | R65.1 111.97,59.56 112.86,58.67 v113.28,58.67 | U16.5 v41.15,47.24
  Top 0.305: C31.1 54.13,57.74 v54.13,56.67 | C28.1 76.31,53.11 v75.18,53.11 72.52,50.44 U11.7 | U14.12 v91.44,51.54 | R46.1 59.73,64.01 v61.47,64.01
  other vias: 94.07,93.05 92.54,91.53 94.45,88.1 92.54,88.1 93.94,91.53 92.54,89.88 87.46,79.59 88.99,79.59 90.51,79.59 76.8,82.13 78.32,82.13 79.84,82.13 81.37,82.13 82.89,82.13 82.89,80.61 81.37,80.61 79.84,80.61 78.32,80.61 76.8,80.61 87.46,78.07 88.99,78.07 90.51,78.07 59.18,98.55 60.71,98.55 59.18,97.03 59.18,95.5 60.71,97.03 60.71,95.5 60.71,93.98 71.12,76.2 60.96,80.26 62.99,76.2 65.02,76.2 67.06,76.2 69.09,76.2 85.85,76.2 73.66,76.2 75.69,76.2 77.72,76.2 79.76,76.2 81.79,76.2 83.82,76.2 52.96,99.06 54.36,97.54 55.88,96.01 57.4,94.49 59.69,90.93 58.93,92.96 52.96,101.6 91.95,76.2 93.98,76.2 96.01,76.2 98.04,76.2 116.33,106.93 117.86,105.41 114.81,108.46 111,100.33 111,101.85 112.78,108.97 110.74,108.97 108.71,108.97 106.68,108.97 104.65,108.97 102.62,108.97 100.58,108.97 98.55,108.97 96.52,108.97 93.98,108.97 91.44,108.97 88.9,108.97 86.36,108.97 83.82,108.97 81.28,108.97 78.74,108.97 76.2,108.97 73.66,108.97 76.45,107.19 74.93,107.19 74.93,105.66 76.45,105.66 76.45,104.14 74.93,104.14 100.84,86.87 100.84,85.6 102.11,86.87 102.11,85.6 102.11,84.07 102.11,82.3 102.11,80.26 117.86,87.12 119.38,87.12 119.63,103.89 121.16,102.36 122.68,100.84 124.21,99.31 125.73,97.79 127.25,96.27 127.25,94.23 127.25,92.2 127.25,90.17 127.25,88.14 127.25,86.11 127.25,84.07 126.24,82.04 124.71,80.52 123.19,78.99 121.67,77.47 120.14,75.95 117.6,75.95 115.06,75.95 112.52,101.85 112.52,100.33 114.05,101.85 114.05,100.33 115.57,100.33 115.57,101.85 117.09,101.85 117.09,100.33 62.99,78.23 65.02,78.23 60.96,78.23 67.06,78.23 62.99,80.26 60.96,76.2 87.88,76.2 89.92,76.2
  pour Top (no thermals): 95.08,85.94 95.08,91.02 96.86,91.02 96.86,95.08 91.27,95.08 91.27,93.31 92.04,92.54 92.04,86.7 89.5,86.7 89.5,87.21 86.96,87.21 86.96,80.1 83.91,80.1 83.91,85.18 75.02,85.18 75.02,84.92 73.75,84.92 73.75,79.08 68.67,79.08 68.67,80.86 59.94,80.86 59.94,75.02 103.21,75.02 103.21,90 100.16,90 100.16,81.62 93.56,81.62 93.56,80.1 91.53,80.1 91.53,82.38 89.5,82.38 89.5,85.94
  pour Route2: 0.09,0.09 160.87,0.09 160.87,111.09 5.97,111.12 5.97,113.54 2.79,113.54 2.79,111.09 0.09,111.09
  pour Top (no thermals): 72.39,109.98 72.39,98.81 74.42,96.77 76.96,96.77 79.5,99.31 84.58,99.31 84.58,91.69 87.88,91.69 87.88,104.39 89.92,106.43 108.2,106.43 108.2,96.01 125.48,96.01 125.48,87.12 122.68,84.33 122.68,80.01 121.16,78.49 111.25,78.49 111.25,74.93 120.65,74.93 128.27,82.55 128.27,96.52 114.81,109.98
  pour Top (no thermals): 117.6,89.41 118.87,89.41 119.89,88.39 119.89,86.61 118.36,86.61 118.11,86.36 118.11,85.34 117.22,84.45 115.32,84.45 115.32,84.84 117.09,84.84 117.35,85.09 117.35,89.15
  pour Top (no thermals): 51.82,106.17 55.12,106.17 55.12,99.31 63.75,99.31 63.75,98.3 64.01,98.3 64.01,90.68 60.45,87.12 58.42,87.12 58.42,91.44 51.82,98.04
HP1_IN
  Top 0.305: U10.12 68.71,61.61 66.42,59.32 C41.1
HP1_OUT
  Top 0.254: U11.15 66.17,52.86 68.07,50.95 68.07,34.54 65.41,31.88 U6.9 U6.10
  Top 0.305: U11.15 C41.2
HP2_OUT1
  Top 0.254: 93.98,54.1 U14.1 93.98,52.86 92.07,50.95 92.07,39.87 90.42,38.23 U7.16 U7.17
  Top 0.305: U14.1 93.98,56.7 93.62,57.06 93.62,59.71 94.45,60.54 R42.2 95.28,61.54 95.28,64.86 90.41,69.72 56.51,69.72 53.98,67.18 46.48,67.18 45.09,68.58 U17.12 45.12,69.21
HP2_OUT2
  Top 0.254: U17.2 48.9,72.52 47.29,70.91 32.11,70.91 31.65,71.37 25.37,71.37 24.38,70.38 U15.8 24.38,68.4 22.81,66.83 22.81,64.31 23.66,63.46 R49.2 24.64,62.27 24.64,43.3 | U8.3 24.64,43.3 | 24.64,43.3 U8.4
HP2_OUT3  (via drill 0.35)
  Top 0.254: U15.1 34.29,74.08 37.04,76.83 R54.2 43.97,76.96 45.09,75.85 U17.5 45.09,72.86 v44.7,72.48 | U8.17 U8.16 31.62,58.29 40.4,67.07 44.18,67.07 v44.2,67.06
  Bottom 0.254: v44.2,67.06 44.2,71.98 v44.7,72.48
HP/LP2_IN1
  Top 0.305: 72.52,68.47 U10.2 72.52,66.93 73.37,66.08 92.61,66.08 94.45,64.24 R41.1
HP/LP2_IN2
  Top 0.254: R48.1 25.02,67.4 25.02,70.38 25.56,70.91 31.46,70.91 31.92,70.45 47.02,70.45 47.62,69.85 U17.14
HP/LP2_IN3
  Top 0.254: R53.1 43.52,82.55 50.8,75.28 50.8,73 48.9,71.1 U17.15 48.9,69.85
INPUT_SELECT0
  Top 0.254: U18.11 40.14,24.26 41.84,22.55 43.87,22.55 49.29,17.14 49.29,13.11 J3.10
INPUT_SELECT1
  Top 0.254: 38.86,22.86 39.41,22.86 U18.10 40.77,22.99 41.66,22.1 43.6,22.1 47.25,18.44 J3.8
INPUT_SELECT2
  Top 0.254: J3.6 39.54,17.77 U18.9
JB1
  Top 0.254: J6.12 121.68,11.85 120.41,10.58 120.41,6.35 J16.12
JB2
  Top 0.254: J6.10 119.14,11.85 117.87,10.58 117.87,6.35 J16.10
JB3
  Top 0.254: J6.8 115.33,11.33 115.33,6.35 J16.8
JB4
  Top 0.254: J6.6 112.79,11.33 112.79,6.35 J16.6
JB7
  Top 0.254: J6.11 122.95,8.79 122.95,3.81 J16.11
JB8
  Top 0.254: J6.9 119.14,6.88 120.41,5.61 120.41,3.81 J16.9
JB9
  Top 0.254: J6.7 116.6,6.88 117.87,5.61 117.87,3.81 J16.7
JB10
  Top 0.254: J6.5 114.06,6.88 115.33,5.61 115.33,3.81 J16.5
JC1
  Top 0.254: J5.12 98.33,11.85 97.06,10.58 97.06,6.35 J15.12
JC2
  Top 0.254: J5.10 95.79,11.85 94.52,10.58 94.52,6.35 J15.10
JC3
  Top 0.254: J5.8 93.25,11.85 91.98,10.58 91.98,6.35 J15.8
JC4
  Top 0.254: J5.6 90.71,11.85 89.44,10.58 89.44,6.35 J15.6
JC7
  Top 0.254: J5.11 99.6,8.79 99.6,3.81 J15.11
JC8
  Top 0.254: J5.9 95.79,6.88 97.06,5.61 97.06,3.81 J15.9
JC9
  Top 0.254: J5.7 93.25,6.88 94.52,5.61 94.52,3.81 J15.7
JC10
  Top 0.254: J5.5 90.71,6.88 91.98,5.61 91.98,3.81 J15.5
JD1
  Top 0.254: J4.12 75.33,11.85 74.06,10.58 74.06,6.35 J14.12
JD2
  Top 0.254: J4.10 72.79,11.85 71.52,10.58 71.52,6.35 J14.10
JD3
  Top 0.254: J4.8 70.25,11.85 68.98,10.58 68.98,6.35 J14.8
JD4
  Top 0.254: J4.6 67.71,11.85 66.44,10.58 66.44,6.35 J14.6
JD7\
  Top 0.254: J4.11 76.6,8.79 76.6,3.81 J14.11
JD8
  Top 0.254: J4.9 72.79,6.88 74.06,5.61 74.06,3.81 J14.9
JD9
  Top 0.254: J4.7 70.25,6.88 71.52,5.61 71.52,3.81 J14.7
JD10
  Top 0.254: J4.5 67.71,6.88 68.98,5.61 68.98,4.55 67.71,3.28 J14.5
JF7
  Top 0.254: J17.11 4.19,50.18 9.05,50.18 J2.11
JF8
  Top 0.254: J17.9 4.19,52.72 9.05,52.72 J2.9
LP1_IN
  Top 0.254: U6.20 U6.21 | 69.34,48.75 69.34,56.01
  Top 0.305: U6.21 73.36,38.23 69.34,42.24 69.34,48.75 | 69.34,56.01 69.34,58.42 72.52,61.59 U10.15
LP1_OUT
  Top 0.254: U6.22 72.77,39.5 70.73,41.54 C38.2 | 70.61,46.85 C38.2 | C38.2 70.73,47.12 69.98,47.87 U11.5
LP2_OUT1
  Top 0.254: C33.2 94.88,47.12 93.98,48.02 U14.14
  Top 0.305: U14.14 93.98,50.55 95,51.56 95,57.15 94.45,57.7 R38.2 95.79,59.25 95.79,65.07 90.62,70.23 56.3,70.23 53.77,67.69 47.24,67.69 46.35,68.58 U17.13
LP2_OUT2
  Top 0.254: R47.2 23.41,60.71 22.35,61.77 22.35,71.37 24.38,73.41 | 24.38,73.41 U15.7 24.38,76.07 23.74,76.72 C37.2 | U17.1 50.16,74.68 49.48,75.36 48.46,75.36 48.26,75.17 48.26,72.53 47.1,71.37 32.29,71.37 31.84,71.83 25.96,71.83 24.38,73.41
LP2_OUT3  (via drill 0.35)
  Top 0.254: C40.2 41.4,44.06 41.91,44.57 41.91,44.58 42.04,44.7 U16.7 42.81,44.76 43.9,44.76 45.09,45.94 v45.09,66.42 | v46.99,72.52 46.99,72.77 47.62,73.41 U17.3 47.62,76.79 44.65,79.76 R52.2
  Bottom 0.254: v45.09,66.42 45.09,70.61 v46.99,72.52
N$1
  Top 0.152: 96.03,86.7 R1.1
  Top 0.508: C3.1 96.29,89.24 | 96.29,86.82 R1.1
  Top 0.813: 96.29,89.24 96.29,86.82
N$2
  pour Top (no thermals): 90,82.89 90,84.16 92.04,84.16 92.54,83.65 99.4,83.65 99.4,82.13 93.05,82.13 93.05,80.61 92.04,80.61 92.04,82.89
N$3
  pour Top (no thermals): 84.92,87.46 84.92,88.99 86.7,90.77 89.24,90.77 89.24,89.24 87.21,89.24 86.45,88.48 86.45,87.46
N$4
  Top 0.762: C2.2 90.19,90.26
  pour Top (no thermals): 90,87.46 91.53,87.46 91.53,92.29 90.26,93.56 90.26,96.1 96.86,96.1 96.86,103.47 100.42,103.47 100.42,101.18 107.53,101.18 107.53,105.75 90,105.75 88.48,104.23 88.48,93.31 90,91.78
N$5
  pour Top (no thermals): 86.45,84.16 84.42,84.16 84.42,80.61 86.45,80.61
N$6
  pour Top (no thermals): 90.04,84.84 92.46,84.84 93.22,84.07 96.77,84.07 96.77,85.34 90.04,85.34
N$7
  pour Top (no thermals): 72.1,84.92 70.95,84.92 69.43,83.4 69.43,81.37 70.95,81.37 70.95,83.65 71.59,84.29 72.1,84.29
N$8
  pour Top (no thermals): 69.43,80.86 73.24,80.86 73.24,79.59 69.43,79.59
N$9
  pour Top (no thermals): 70.1,89.28 72.52,89.28 72.52,83.57 71.75,83.57 71.75,81.41 73.15,81.41 73.15,85.34 74.55,85.34 74.55,85.72 73.15,85.72 73.15,90.68 70.1,90.68
N$10
  pour Top (no thermals): 63.75,101.09 63.75,102.11 64.77,103.12 64.77,104.39 63.75,104.39 63.75,102.87 62.99,102.11 62.99,101.09
N$11
  pour Top (no thermals): 69.68,86.19 72.1,86.19 72.1,86.83 68.03,86.83 66.89,85.69 66.89,81.37 68.67,81.37 68.67,85.18
N$12
  pour Top (no thermals): 60.71,102.11 61.59,103 62.99,103 62.99,104.39 59.18,104.39 59.18,102.11
N$13
  pour Top (no thermals): 55.63,99.95 55.63,102.62 57.91,102.62 57.91,101.35 61.98,101.35 62.74,100.58 64.64,100.58 64.64,98.81 64.14,98.81 64.14,99.95
N$14
  pour Top (no thermals): 71.63,99.95 65.02,99.95 65.02,101.85 67.31,104.14 71.63,104.14
N$15
  pour Top (no thermals): 111.25,86.49 109.73,86.49 109.73,89.92 112.01,92.2 112.01,95.5 116.08,95.5 116.08,93.98 114.55,92.46 113.79,92.46 111.25,89.92
N$16
  pour Top (no thermals): 115.32,78.99 115.32,82.8 118.11,82.8 119.38,81.53 121.92,81.53 121.92,80.01 120.9,78.99
N$17
  Top 0.305: R39.2 C31.2 56.82,59.57 R40.1
N$18
  pour Top (no thermals): 115.32,84.07 117.35,84.07 118.62,85.34 118.62,86.11 119.89,86.11 119.89,84.58 119.13,83.82 115.32,83.82
N$19
  pour Top (no thermals): 115.32,83.19 118.24,83.19 119.38,82.04 121.92,82.04 121.92,83.44 115.32,83.44
N$20
  pour Top (no thermals): 115.32,86.36 115.32,87.63 115.57,87.88 115.57,89.41 116.84,89.41 116.84,86.36
N$21
  Top 0.305: C34.2 59.62,62.09 R46.2 C35.1
N$22
  Top 0.254: U6.16 U6.17 78.13,33.15 81.9,36.91 81.9,47.13 84.57,49.8 88.9,54.13 U14.5 | 88.9,53.98 U14.5 | U14.5 88.9,55.46 87.77,56.59 C42.2
N$23  (via drill 0.35)
  Top 0.254: U14.7 U14.6 | U6.4 U6.3
  Top 0.305: U14.7 86.11,54.78 77.89,46.57 75.02,43.69 v71.63,43.69 | v66.15,40.16 65.49,39.5 U6.3
  Bottom 0.305: v71.63,43.69 68.1,40.16 v66.15,40.16
N$24
  Top 0.254: 127.51,54.1 U12.2 127.51,55.5 128.07,56.06 130.25,56.06 130.98,55.33 R59.1 | R57.1 132.46,52.16 132.46,55.33
  Top 0.305: R59.1 132.46,55.33 R58.2
N$25
  Top 0.254: U14.3 91.44,59.69 90.13,61 R45.1 R44.2
N$26
  Top 0.254: 92.71,54.1 U14.2
  Top 0.305: U14.2 92.71,57.7 R38.1 R42.1 R41.2
N$27
  Top 0.254: R18.2 R17.1 76.92,41.91 74.93,41.91 74.8,42.04 U6.24
N$28
  Top 0.254: U14.9 87.63,46.98 C32.1 87.39,46.47 90.42,43.43 90.42,40.13 89.79,39.5 U7.15
N$29
  Top 0.254: U7.21 U7.20 84.33,33.15 82.54,34.94 82.54,43.69 C32.2 85.59,46.86 86.36,47.64 U14.8 86.36,50.52 89.54,53.7 89.54,55.85 89.03,56.36 89.03,59.18 88.18,60.03 R45.2
N$30
  Top 0.254: U14.13 92.71,47.11 C33.1 93.08,33.39 90.3,30.61 U7.22
N$31
  Top 0.254: R50.2 R51.1 27.98,63.84 26.92,64.9 U15.10
N$32
  Top 0.254: R47.1 R49.1 R48.2 25.65,66.08 U15.9
N$33
  Top 0.254: R20.2 R19.1 61.64,29.34 U6.11
N$34
  Top 0.254: U15.13 30.73,68.07 32.12,66.69 C36.1 32.12,60.19 29.72,57.79 29.72,49.3 26.54,46.12 U8.5
N$35
  Top 0.254: 33.92,66.04 C36.2 33.92,67.81 32.55,69.17 U15.14 32,69.72 31.27,70.45 29.03,70.45 28.82,70.25 28.82,63.75 | U8.21 U8.20 26.54,57.91 28.82,60.19 28.82,63.75 | R51.2 28.82,63.75
N$36
  Top 0.254: 25.54,74.2 U15.6 25.65,76.85 C37.1 24.53,77.97 23.2,77.97 21.89,76.66 21.89,60.15 24,58.04 U8.22
N$37
  Top 0.254: U15.3 29.46,75.44 30.77,76.75 R55.2 R56.1
N$38
  Top 0.254: U15.2 30.73,74.8 31.5,75.56 33.91,75.56 35.09,76.75 R54.1 R52.1 R53.2
N$39
  Top 0.254: R22.2 R21.1 76.79,29.34 U6.14
N$40
  Top 0.254: U16.2 39.74,51.05 C39.1 38.56,50.11 34.73,50.11 32.89,51.94 U8.15
N$41  (via drill 0.35)
  Top 0.254: U16.1 40.64,52.32 39.99,52.97 C39.2 v39.62,65.02 | U16.1 42.88,52.2 43.43,52.2 | U8.9 U8.10 32.89,43.94 33.95,45 40.31,45 40.65,45.34 43.84,45.34 44.04,45.54 44.04,51.49 43.2,52.32 U16.1 | R56.2 33.91,78.57 v33.91,78.23
  Bottom 0.254: v33.91,78.23 39.62,72.52 v39.62,65.02
N$42
  Top 0.254: U16.6 39.74,45.97 C40.1 32.14,45.86 30.35,44.07 U8.8
N$43
  Top 0.254: U16.12 62.97,49.78 64.37,51.18 66.93,51.18 67.44,50.67 U11.3
N$44
  Top 0.254: R24.2 R23.1 61.64,40.77 U6.2
N$45
  Top 0.254: R26.2 R25.1 88.85,27.9 U7.24
N$46
  Top 0.254: R28.2 R27.1 101.18,40.77 U7.11
N$47
  Top 0.254: R31.2 R30.1 86.27,40.77 U7.14
N$48
  Top 0.254: R32.1 R33.2 101.18,29.34 U7.2
N$49
  Top 0.254: R35.2 R34.1 21.46,55.46 U8.24
N$50
  Top 0.254: R36.1 R37.2 34.16,40.3 U8.11
N$51
  Top 0.254: R68.2 R67.1 34.16,55.71 U8.14
N$52
  Top 0.254: R70.2 R69.1 22.73,40.3 U8.2
N$53
  Top 0.254: 126.58,42.55 R71.1 R72.2 124.06,42.77 123.32,42.04 U9.24
N$54
  Top 0.254: R73.1 R74.2 112.22,29.17 U9.11
N$55
  Top 0.254: R75.1 R76.2 124.29,29.34 U9.14
N$56
  Top 0.254: R78.2 R77.1 109.9,40.77 U9.2 112.22,40.94
N$57
  Top 0.254: U12.3 126.24,56.39 127.04,57.19 R61.1 R60.2
N$58
  Top 0.254: R59.2 129.47,51.53 127.45,51.53 126.87,50.95 126.87,48.28 126.64,48.06 126.64,45.7 127.7,44.64 127.7,40.07 125.86,38.23 U9.21
  Top 0.305: U9.20 U9.21 | U12.1 129.92,54.78 R59.2
N$59
  Top 0.254: U12.9 122.57,49.73 C44.1
  Top 0.305: C44.1 122.57,44.61 120.44,42.48 120.44,40.07 121.01,39.5 U9.22
N$61
  Top 0.254: 127.62,49.75 U12.13 127.51,47.38 C45.1 | U9.15 122.56,30.61 124.02,32.07 | 127.37,46.99 128.18,46.18
  Top 0.305: C45.1 127.37,46.99 | 123.95,32 124.02,32.07 128.18,36.23 128.18,46.18
N$62
  Top 0.254: U12.14 128.78,47.64 C45.2 | U9.9 U9.10 | 120.63,29.97 123.06,29.97
  Top 0.305: U12.14 129.96,51.05 R57.2 | C45.2 129.17,35.94 123.2,29.97 123.06,29.97 | 113.16,30.61 U9.10 120,30.61 120.63,29.97
N$63
  Top 0.305: U9.8 113.67,33.15 118.15,37.63 118.15,48.75 123.08,53.68 123.08,54.16 U12.5 123.7,56.53 123.07,57.15 C46.2
N$64
  Top 0.254: U12.6 U12.7 121.16,54.44 117.6,54.44 116.71,53.55 R63.1
N$65
  Top 0.254: U13.2 110.5,54.2 113.13,51.56 114.26,51.56 R64.1 R63.2 116.55,51.56 R62.1
N$66
  Top 0.254: U13.3 109.22,56.39 110.02,57.19 R66.1 R65.2
N$67
  Top 0.254: U13.1 114.3,54.78 | C49.1 104.26,58.54 106.93,61.21 112.52,61.21 114.3,59.44 114.3,54.78 | 114.3,54.78 R64.2
  Top 0.305: R64.2 114.59,53.55 115.59,52.56 117.31,52.56 117.64,52.23 117.64,43.47 113.67,39.5 U9.3 U9.4
N$68
  Top 0.254: U13.13 110.49,47.38 C47.1 110.1,44.82 109.98,44.71 107.62,44.71 106.41,43.5 106.41,40.32 106.73,40 108.59,40 111.63,36.96 U9.5
N$69
  Top 0.254: R66.2 110.63,56.06 110.05,56.06 109.85,55.86 109.85,53.22 | U7.9 U7.10 97.79,39.5 97.1,40.19 97.1,42.47 103.02,48.39 103.02,50.59 104.07,51.64 108.27,51.64 109.85,53.22 | 109.85,53.22 111.76,51.31 U13.14 111.76,47.13 C47.2
N$70
  Top 0.254: U13.9 105.41,47.13 C48.1 105.55,41.21 104.47,40.13 103.38,40.13 100.2,36.96 U7.8
N$71
  Top 0.254: 114.26,49.87 R62.2 114.66,49.47 114.66,47.32 113.2,45.86 111.49,45.86 111.12,46.22 111.12,50.95 110.89,51.18 105,51.18 104.78,50.96 104.78,50.51 U13.8 104.14,47.38 C48.2
N$72
  Top 0.254: C49.2 106.68,56.78 U13.5 | U7.3 U7.4
  Top 0.305: U13.5 106.68,52.88 105.92,52.12 103.87,52.12 102.53,50.79 102.53,48.59 96.62,42.67 96.62,32.92 97.66,31.88 U7.4
N$73
  Top 0.305: U19.7 143.38,46.82 R83.1 143.72,46.44 147.96,42.21 J7.12
N$74
  Top 0.305: R84.1 R83.2 142.11,46.82 U19.6
NOTCH_IN
  Top 0.305: U10.14 71.25,63.5 69.82,64.92 57.93,64.92 C34.1 56.82,63.97 R39.1
NOTCH_OUT
  Top 0.305: U11.14 67.2,55.02 67.2,58.15 66.93,58.42 60.59,58.42 59.94,57.77 C35.2 59.62,57.7 R40.2
PASSTHROUGH
  Top 0.305: U10.13 69.98,61.59 68.71,60.33 U11.13
SCL  (via drill 0.35)
  Top 0.254: J17.10 8.53,51.45 9.8,50.18 11.6,50.18 J2.10 14.38,51.45 R14.1 20.36,49.57 22.73,51.94 U8.23 | U9.23 122.3,40.77 v123.7,39.37 | U7.23 v87.12,29.34 | v80.26,36.45 75.95,40.77 U6.23
  Bottom 0.254: v123.7,39.37 113.92,29.59 | v80.26,36.45 80.26,36.2 v87.12,29.34
  Bottom 0.305: J2.10 34.74,51.45 61.77,24.41 82.2,24.41 v87.12,29.34 113.67,29.34 113.92,29.59
SDA  (via drill 0.35)
  Top 0.254: J17.8 8.53,53.99 9.8,52.72 11.6,52.72 J2.8 14.4,53.99 R15.1 | U9.13 121.8,26.8 119.64,24.64 76.45,24.64 75.18,25.91 | 75.18,25.91 74.05,27.05 U6.13 | U7.13 v89.02,43.17 v89.03,43.18 | 75.18,25.91 v74.42,25.15 | U8.13 35.57,52.58 v36.58,52.58
  Bottom 0.254: v36.58,52.58 36.7,52.45
  Bottom 0.305: J2.8 35.17,53.99 36.7,52.45 36.7,50.29 61.85,25.15 v74.42,25.15 74.42,31.64 86.06,43.28 88.93,43.28 v89.03,43.18
UART0_RX
  Top 0.254: J17.7 4.19,55.26 9.05,55.26 J2.7
UART0_TX
  Top 0.254: J17.5 4.19,57.8 9.05,57.8 J2.5
UART1_RX
  Top 0.254: J17.12 6.73,47.64 11.6,47.64 J2.12
UART1_TX
  Top 0.254: J17.6 8.53,56.53 9.8,55.26 11.6,55.26 J2.6
VIN_BUFFERED
  Top 0.305: U16.8 U16.9 46.99,45.97 46.36,46.6 46.36,55.11 46.35,55.12 46.35,60.71 52.32,66.67 54.19,66.67 56.72,69.21 70.36,69.21 71.25,68.33 U10.3
XADC_J14
  Top 0.254: J7.5 153.78,34.59 155.05,33.32 156.85,33.32 J21.5
XADC_J16
  Top 0.254: J7.7 153.78,37.13 155.05,35.86 156.85,35.86 J21.7
XADC_K14
  Top 0.254: J7.6 148.83,34.59 150.1,35.86 154.31,35.86 J21.6
XADC_K16
  Top 0.254: J7.8 148.83,37.13 150.1,38.4 154.31,38.4 J21.8
XADC_L14
  Top 0.254: J7.10 149.35,40.94 154.31,40.94 J21.10
XADC_L15
  Top 0.254: J7.9 153.78,39.67 155.05,38.4 156.85,38.4 J21.9
XADC_N1
  Top 0.305: C71.1 R81.1 | R82.2 R81.1 | U19.3 142.11,58.08 R81.1
XADC_N15
  Top 0.305: U19.5 140.84,50.55 141.73,51.44 147.57,51.44 147.66,51.35 R80.2 R79.1

## Text on the board
tDocu: Set ref plane pullback